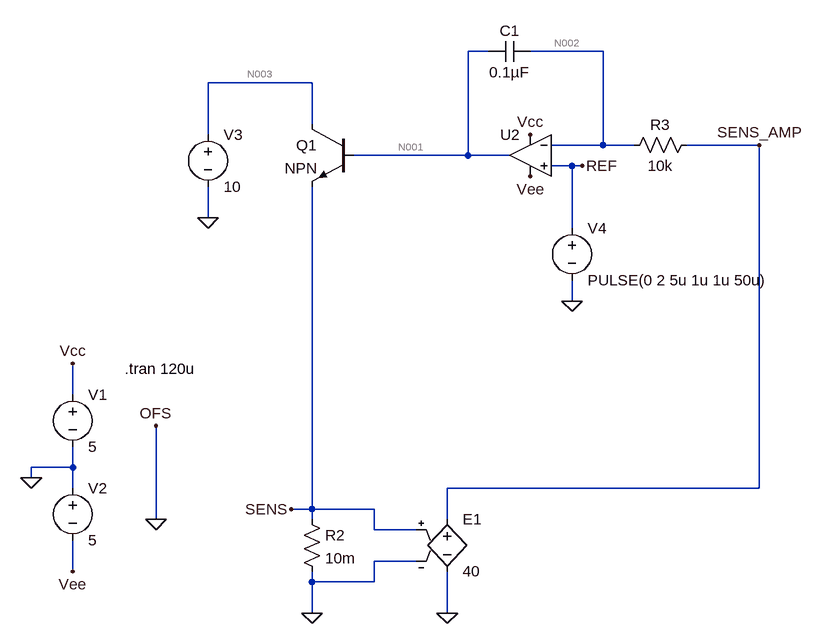
[diagram p0: schematic PIctrl.asc]
PIctrl.asc, the LTspice schematic file:
Version 4.1
SHEET 1 880 680
WIRE 0 -544 -32 -544
WIRE 176 -544 64 -544
WIRE -272 -496 -432 -496
WIRE -272 -432 -272 -496
WIRE -432 -416 -432 -496
WIRE 176 -400 176 -544
WIRE 176 -400 96 -400
WIRE 224 -400 176 -400
WIRE 416 -400 304 -400
WIRE -32 -384 -32 -544
WIRE -32 -384 -208 -384
WIRE 32 -384 -32 -384
WIRE 128 -368 96 -368
WIRE 144 -368 128 -368
WIRE -432 -288 -432 -336
WIRE 128 -272 128 -368
WIRE 128 -160 128 -192
WIRE -640 -16 -640 -64
WIRE -640 96 -640 64
WIRE -640 96 -704 96
WIRE -704 112 -704 96
WIRE -640 128 -640 96
WIRE 416 128 416 -400
WIRE 416 128 -64 128
WIRE -272 160 -272 -336
WIRE -272 160 -304 160
WIRE -176 160 -272 160
WIRE -512 176 -512 32
WIRE -272 176 -272 160
WIRE -64 176 -64 128
WIRE -176 192 -176 160
WIRE -112 192 -176 192
WIRE -112 240 -176 240
WIRE -640 256 -640 208
WIRE -272 272 -272 256
WIRE -176 272 -176 240
WIRE -176 272 -272 272
WIRE -272 320 -272 272
WIRE -64 320 -64 256
FLAG -640 -64 Vcc
FLAG -640 256 Vee
FLAG -704 112 0
FLAG -512 176 0
FLAG -512 32 OFS
FLAG -272 320 0
FLAG 64 -416 Vcc
FLAG 64 -352 Vee
FLAG 128 -160 0
FLAG 416 -400 SENS_AMP
FLAG 144 -368 REF
FLAG -304 160 SENS
FLAG -64 320 0
FLAG -432 -288 0
SYMBOL voltage -640 -32 R0
WINDOW 123 0 0 Left 0
WINDOW 39 0 0 Left 0
SYMATTR InstName V1
SYMATTR Value 5
SYMBOL voltage -640 112 R0
WINDOW 123 0 0 Left 0
WINDOW 39 0 0 Left 0
SYMATTR InstName V2
SYMATTR Value 5
SYMBOL res -288 160 R0
SYMATTR InstName R2
SYMATTR Value 10m
SYMBOL res 320 -416 R90
WINDOW 0 0 56 VBottom 2
WINDOW 3 32 56 VTop 2
SYMATTR InstName R3
SYMATTR Value 10k
SYMBOL cap 64 -560 R90
WINDOW 0 0 32 VBottom 2
WINDOW 3 32 32 VTop 2
SYMATTR InstName C1
SYMATTR Value 0.1µF
SYMBOL voltage 128 -288 R0
WINDOW 123 0 0 Left 0
WINDOW 39 0 0 Left 0
SYMATTR InstName V4
SYMATTR Value PULSE(0 2 5u 1u 1u 50u)
SYMBOL OpAmps\\UniversalOpAmp 64 -384 M0
SYMATTR InstName U2
SYMATTR Value2 Avol=1Meg GBW=10Meg Vos=1
SYMBOL e -64 160 R0
SYMATTR InstName E1
SYMATTR Value 40
SYMBOL npn -208 -432 M0
SYMATTR InstName Q1
SYMBOL voltage -432 -432 R0
WINDOW 123 0 0 Left 0
WINDOW 39 0 0 Left 0
SYMATTR InstName V3
SYMATTR Value 10
TEXT -560 -56 Left 2 !.tran 120u

The netlist it stands for:
* PIctrl.asc
V1 Vcc 0 5
V2 0 Vee 5
R2 SENS 0 10m
R3 SENS_AMP N002 10k
C1 N002 N001 0.1µF
V4 REF 0 PULSE(0 2 5u 1u 1u 50u)
X§U2 REF N002 Vcc Vee N001 level1 Avol=1Meg GBW=10Meg Vos=1 En=0 Enk=0 In=0 Ink=0 Rin=500Meg  ; pins In+ In- V+ V- OUT
E1 SENS_AMP 0 SENS 0 40
Q1 N003 N001 SENS 0 NPN
V3 N003 0 10
.model NPN NPN
.model PNP PNP
.lib standard.bjt
.tran 120u
.lib UniversalOpAmp1.lib
.backanno
.end

* Results of the author's LTspice run, read from the files saved beside the schematic
* Operating Point, zero values left out:
*   V(n001) = 1.001 V
*   V(n002) = 1 V
*   V(n003) = 10 V
*   V(sens) = 25 mV
*   V(sens_amp) = 1 V
*   V(vcc) = 5 V
*   V(vee) = -5 V
*   I(E1) = -2 nA
*   I(R2) = 2.5 A
*   I(R3) = 2 nA
*   I(V1) = -9 nA
*   I(V2) = -11 nA
*   I(V3) = -2.475 A
*   Ib(Q1) = 24.75 mA
*   Ic(Q1) = 2.475 A
*   Ie(Q1) = -2.5 A
*   Ix(u2:2) = 2 nA
*   Ix(u2:3) = 9 nA
*   Ix(u2:4) = -11 nA
*   Ix(u2:5) = -24.75 mA
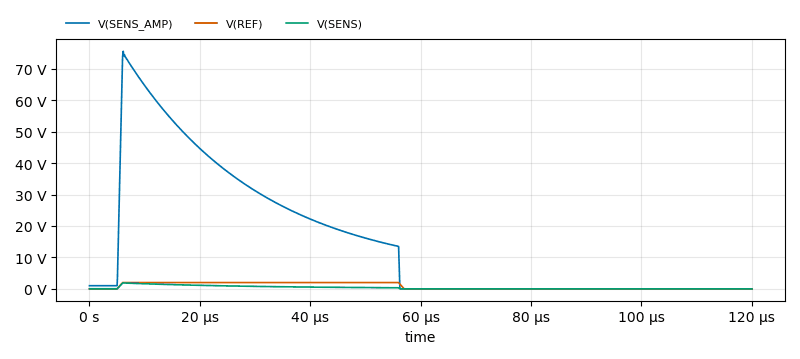
[diagram p1: Transient Analysis of PIctrl.asc, plotted from the saved traces]
* Transient Analysis, 1 run:
*   V(SENS_AMP): min 0 V, max 75.6 V, average 14.83 V, rms 25.33 V, last 0 V
*   V(REF): min 0 V, max 2 V, average 850 mV, rms 1.3 V, last 0 V
*   V(SENS): min 0 V, max 1.89 V, average 370.6 mV, rms 633.3 mV, last 0 V